# Altium schematic sheet Relay.SchDoc
size C; SheetNumber: 8; SheetTotal: 15
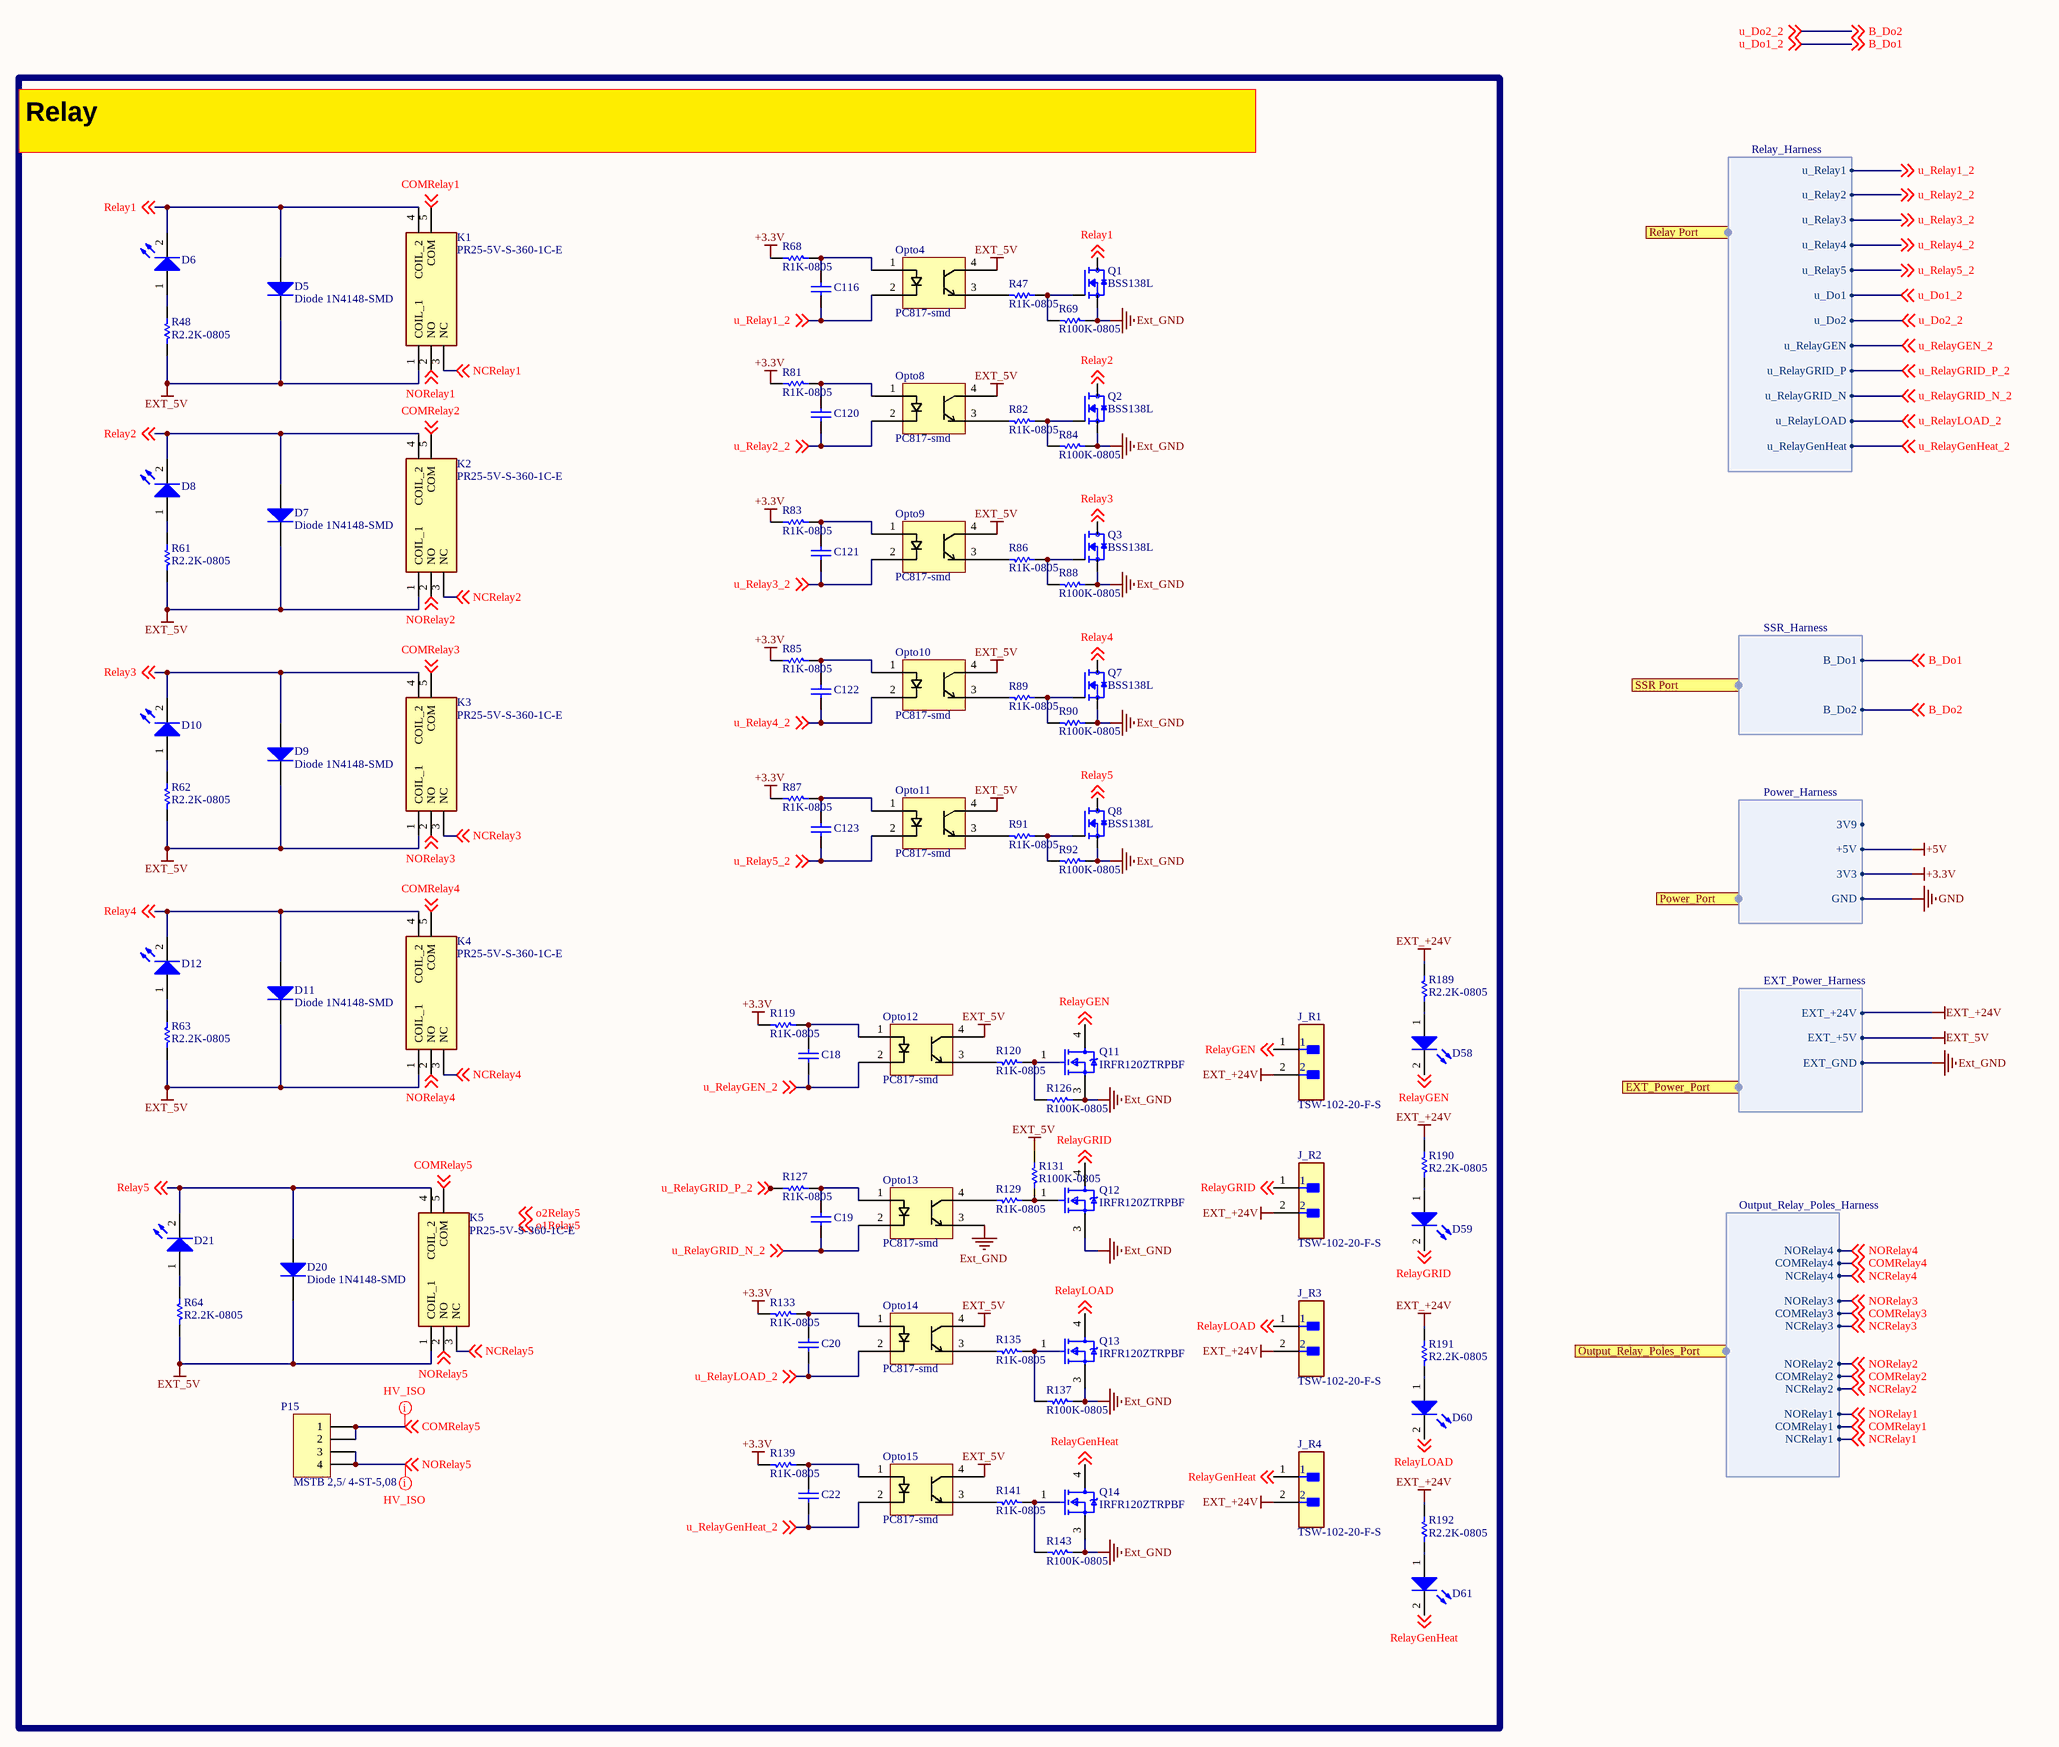
[diagram p0: Relay.SchDoc]

## Parts
C18  (no value)  [CRF06031]
C19  (no value)  [CRF06031]
C20  (no value)  [CRF06031]
C22  (no value)  [CRF06031]
C116  (no value)  [CRF06031]
C120  (no value)  [CRF06031]
C121  (no value)  [CRF06031]
C122  (no value)  [CRF06031]
C123  (no value)  [CRF06031]
D5  Diode 1N4148-SMD  [d1206]
D6  LED_0805_green  [0805-LED]  (value not drawn)
D7  Diode 1N4148-SMD  [d1206]
D8  LED_0805_green  [0805-LED]  (value not drawn)
D9  Diode 1N4148-SMD  [d1206]
D10  LED_0805_green  [0805-LED]  (value not drawn)
D11  Diode 1N4148-SMD  [d1206]
D12  LED_0805_green  [0805-LED]  (value not drawn)
D20  Diode 1N4148-SMD  [d1206]
D21  LED_0805_green  [0805-LED]  (value not drawn)
D58  LED_0805_green  [0805-LED]  (value not drawn)
D59  LED_0805_green  [0805-LED]  (value not drawn)
D60  LED_0805_green  [0805-LED]  (value not drawn)
D61  LED_0805_green  [0805-LED]  (value not drawn)
J_R1  TSW-102-20-F-S  [FP-TSW-102-12-T-S-MFG]
J_R2  TSW-102-20-F-S  [FP-TSW-102-12-T-S-MFG]
J_R3  TSW-102-20-F-S  [FP-TSW-102-12-T-S-MFG]
J_R4  TSW-102-20-F-S  [FP-TSW-102-12-T-S-MFG]
K1  PR25-5V-S-360-1C-E  [PR255VS3601CE]
K2  PR25-5V-S-360-1C-E  [PR255VS3601CE]
K3  PR25-5V-S-360-1C-E  [PR255VS3601CE]
K4  PR25-5V-S-360-1C-E  [PR255VS3601CE]
K5  PR25-5V-S-360-1C-E  [PR255VS3601CE]
Opto4  PC817-smd  [PC817_SMD1]
Opto8  PC817-smd  [PC817_SMD1]
Opto9  PC817-smd  [PC817_SMD1]
Opto10  PC817-smd  [PC817_SMD1]
Opto11  PC817-smd  [PC817_SMD1]
Opto12  PC817-smd  [PC817_SMD1]
Opto13  PC817-smd  [PC817_SMD1]
Opto14  PC817-smd  [PC817_SMD1]
Opto15  PC817-smd  [PC817_SMD1]
P15  MSTB 2,5/ 4-ST-5,08  [MSTB 2,5/4-G-5,08]
Q1  BSS138L  [BSS138L]
Q2  BSS138L  [BSS138L]
Q3  BSS138L  [BSS138L]
Q7  BSS138L  [BSS138L]
Q8  BSS138L  [BSS138L]
Q11  IRFR120ZTRPBF  [FP-PG-TO252-3-MFG]
Q12  IRFR120ZTRPBF  [FP-PG-TO252-3-MFG]
Q13  IRFR120ZTRPBF  [FP-PG-TO252-3-MFG]
Q14  IRFR120ZTRPBF  [FP-PG-TO252-3-MFG]
R47  R1K-0805  [CRF06031]
R48  R2.2K-0805  [CRF06031]
R61  R2.2K-0805  [CRF06031]
R62  R2.2K-0805  [CRF06031]
R63  R2.2K-0805  [CRF06031]
R64  R2.2K-0805  [CRF06031]
R68  R1K-0805  [CRF06031]
R69  R100K-0805  [CRF06031]
R81  R1K-0805  [CRF06031]
R82  R1K-0805  [CRF06031]
R83  R1K-0805  [CRF06031]
R84  R100K-0805  [CRF06031]
R85  R1K-0805  [CRF06031]
R86  R1K-0805  [CRF06031]
R87  R1K-0805  [CRF06031]
R88  R100K-0805  [CRF06031]
R89  R1K-0805  [CRF06031]
R90  R100K-0805  [CRF06031]
R91  R1K-0805  [CRF06031]
R92  R100K-0805  [CRF06031]
R119  R1K-0805  [CRF06031]
R120  R1K-0805  [CRF06031]
R126  R100K-0805  [CRF06031]
R127  R1K-0805  [CRF06031]
R129  R1K-0805  [CRF06031]
R131  R100K-0805  [CRF06031]
R133  R1K-0805  [CRF06031]
R135  R1K-0805  [CRF06031]
R137  R100K-0805  [CRF06031]
R139  R1K-0805  [CRF06031]
R141  R1K-0805  [CRF06031]
R143  R100K-0805  [CRF06031]
R189  R2.2K-0805  [CRF06031]
R190  R2.2K-0805  [CRF06031]
R191  R2.2K-0805  [CRF06031]
R192  R2.2K-0805  [CRF06031]

## Ports
EXT_Power_Port (harness EXT_Power_Harness), Output_Relay_Poles_Port (harness Output_Relay_Poles_Harness), Power_Port (harness Power_Harness), Relay Port (harness Relay_Harness), SSR Port (harness SSR_Harness)

## Harnesses
Relay_Harness: u_Relay1, u_Relay2, u_Relay3, u_Relay4, u_Relay5, u_Do1, u_Do2, u_RelayGEN, u_RelayGRID_P, u_RelayGRID_N, u_RelayLOAD, u_RelayGenHeat
SSR_Harness: B_Do1, B_Do2
Power_Harness: 3V9, +5V, 3V3, GND
EXT_Power_Harness: EXT_+24V, EXT_+5V, EXT_GND
Output_Relay_Poles_Harness: NCRelay1, NCRelay2, NCRelay3, NCRelay4, COMRelay1, COMRelay2, COMRelay3, COMRelay4, NORelay1, NORelay2, NORelay3, NORelay4

## Nets
+3.3V: R68.2 R81.2 R83.2 R85.2 R87.2 R119.2 R133.2 R139.2 ; port Power_Port.3V3
+5V: port Power_Port.+5V
EXT_5V: D5.2(K) D7.2(K) D9.2(K) D11.2(K) D20.2(K) K1.1(COIL_1) K2.1(COIL_1) K3.1(COIL_1) K4.1(COIL_1) K5.1(COIL_1) Opto4.4 Opto8.4 Opto9.4 Opto10.4 Opto11.4 Opto12.4 Opto14.4 Opto15.4 R48.2 R61.2 R62.2 R63.2 R64.2 R131.2 ; port EXT_Power_Port.EXT_+5V
EXT_+24V: J_R1.2 J_R2.2 J_R3.2 J_R4.2 R189.2 R190.2 R191.2 R192.2 ; port EXT_Power_Port.EXT_+24V
Ext_GND: Opto13.3 Q1.S Q2.S Q3.S Q7.S Q8.S Q11.3(SOURCE) Q12.3(SOURCE) Q13.3(SOURCE) Q14.3(SOURCE) R69.2 R84.2 R88.2 R90.2 R92.2 R126.2 R137.2 R143.2 ; port EXT_Power_Port.EXT_GND
GND: port Power_Port.GND
B_Do1: off-sheet B_Do1, off-sheet u_Do1_2, port Relay Port.u_Do1, port SSR Port.B_Do1  [also labelled u_Do1_2]
B_Do2: off-sheet B_Do2, off-sheet u_Do2_2, port Relay Port.u_Do2, port SSR Port.B_Do2  [also labelled u_Do2_2]
COMRelay1: K1.5(COM) ; off-sheet COMRelay1, port Output_Relay_Poles_Port.COMRelay1
COMRelay2: K2.5(COM) ; off-sheet COMRelay2, port Output_Relay_Poles_Port.COMRelay2
COMRelay3: K3.5(COM) ; off-sheet COMRelay3, port Output_Relay_Poles_Port.COMRelay3
COMRelay4: K4.5(COM) ; off-sheet COMRelay4, port Output_Relay_Poles_Port.COMRelay4
COMRelay5: K5.5(COM) P15.1 P15.2 ; off-sheet COMRelay5
NCRelay1: K1.3(NC) ; off-sheet NCRelay1, port Output_Relay_Poles_Port.NCRelay1
NCRelay2: K2.3(NC) ; off-sheet NCRelay2, port Output_Relay_Poles_Port.NCRelay2
NCRelay3: K3.3(NC) ; off-sheet NCRelay3, port Output_Relay_Poles_Port.NCRelay3
NCRelay4: K4.3(NC) ; off-sheet NCRelay4, port Output_Relay_Poles_Port.NCRelay4
NCRelay5: K5.3(NC) ; off-sheet NCRelay5
NORelay1: K1.2(NO) ; off-sheet NORelay1, port Output_Relay_Poles_Port.NORelay1
NORelay2: K2.2(NO) ; off-sheet NORelay2, port Output_Relay_Poles_Port.NORelay2
NORelay3: K3.2(NO) ; off-sheet NORelay3, port Output_Relay_Poles_Port.NORelay3
NORelay4: K4.2(NO) ; off-sheet NORelay4, port Output_Relay_Poles_Port.NORelay4
NORelay5: K5.2(NO) P15.3 P15.4 ; off-sheet NORelay5
Relay1: D5.1(A) D6.2(K) K1.4(COIL_2) Q1.D ; off-sheet Relay1
Relay2: D7.1(A) D8.2(K) K2.4(COIL_2) Q2.D ; off-sheet Relay2
Relay3: D9.1(A) D10.2(K) K3.4(COIL_2) Q3.D ; off-sheet Relay3
Relay4: D11.1(A) D12.2(K) K4.4(COIL_2) Q7.D ; off-sheet Relay4
Relay5: D20.1(A) D21.2(K) K5.4(COIL_2) Q8.D ; off-sheet Relay5
RelayGEN: D58.2(K) J_R1.1 Q11.4(DRAIN) ; off-sheet RelayGEN
RelayGenHeat: D61.2(K) J_R4.1 Q14.4(DRAIN) ; off-sheet RelayGenHeat
RelayGRID: D59.2(K) J_R2.1 Q12.4(DRAIN) ; off-sheet RelayGRID
RelayLOAD: D60.2(K) J_R3.1 Q13.4(DRAIN) ; off-sheet RelayLOAD
u_Relay1_2: C116.1 Opto4.2 ; off-sheet u_Relay1_2, port Relay Port.u_Relay1
u_Relay2_2: C120.1 Opto8.2 ; off-sheet u_Relay2_2, port Relay Port.u_Relay2
u_Relay3_2: C121.1 Opto9.2 ; off-sheet u_Relay3_2, port Relay Port.u_Relay3
u_Relay4_2: C122.1 Opto10.2 ; off-sheet u_Relay4_2, port Relay Port.u_Relay4
u_Relay5_2: C123.1 Opto11.2 ; off-sheet u_Relay5_2, port Relay Port.u_Relay5
u_RelayGEN_2: C18.1 Opto12.2 ; off-sheet u_RelayGEN_2, port Relay Port.u_RelayGEN
u_RelayGenHeat_2: C22.1 Opto15.2 ; off-sheet u_RelayGenHeat_2, port Relay Port.u_RelayGenHeat
u_RelayGRID_N_2: C19.1 Opto13.2 ; off-sheet u_RelayGRID_N_2, port Relay Port.u_RelayGRID_N
u_RelayGRID_P_2: R127.2 ; off-sheet u_RelayGRID_P_2, port Relay Port.u_RelayGRID_P
u_RelayLOAD_2: C20.1 Opto14.2 ; off-sheet u_RelayLOAD_2, port Relay Port.u_RelayLOAD
NetC18_2: C18.2 Opto12.1 R119.1
NetC19_2: C19.2 Opto13.1 R127.1
NetC20_2: C20.2 Opto14.1 R133.1
NetC22_2: C22.2 Opto15.1 R139.1
NetC116_2: C116.2 Opto4.1 R68.1
NetC120_2: C120.2 Opto8.1 R81.1
NetC121_2: C121.2 Opto9.1 R83.1
NetC122_2: C122.2 Opto10.1 R85.1
NetC123_2: C123.2 Opto11.1 R87.1
NetD6_1: D6.1(A) R48.1
NetD8_1: D8.1(A) R61.1
NetD10_1: D10.1(A) R62.1
NetD12_1: D12.1(A) R63.1
NetD21_1: D21.1(A) R64.1
NetD58_1: D58.1(A) R189.1
NetD59_1: D59.1(A) R190.1
NetD60_1: D60.1(A) R191.1
NetD61_1: D61.1(A) R192.1
NetOpto4_3: Opto4.3 R47.2
NetOpto8_3: Opto8.3 R82.2
NetOpto9_3: Opto9.3 R86.2
NetOpto10_3: Opto10.3 R89.2
NetOpto11_3: Opto11.3 R91.2
NetOpto12_3: Opto12.3 R120.2
NetOpto13_4: Opto13.4 R129.2
NetOpto14_3: Opto14.3 R135.2
NetOpto15_3: Opto15.3 R141.2
NetQ1_G: Q1.G R47.1 R69.1
NetQ2_G: Q2.G R82.1 R84.1
NetQ3_G: Q3.G R86.1 R88.1
NetQ7_G: Q7.G R89.1 R90.1
NetQ8_G: Q8.G R91.1 R92.1
NetQ11_1: Q11.1(GATE) R120.1 R126.1
NetQ12_1: Q12.1(GATE) R129.1 R131.1
NetQ13_1: Q13.1(GATE) R135.1 R137.1
NetQ14_1: Q14.1(GATE) R141.1 R143.1

## Layout directives
net class HV_ISO: COMRelay5, NORelay5

## Notes on the sheet
- Relay
- Labels drawn without touching a wire or pin: o1Relay5, o2Relay5

## Library data of the parts
C18-C20 C22 C116 C120-C123 = Cap: Capacitor; Manufacturer_P/N: GCM21BR72A104KA37L; Digi-Key_Part_Number: 490-4789-1-ND; JLC P/N: C85866
  C116 C120-C122: ClassName: OutputRelays
  C123: ClassName: HeaterRelay
D5 D7 D9 D11 D20 = Diode 1N4934: 1 Amp Fast Recovery Rectifier; Manufacturer_P/N: 1N4148WS; Digi-Key_Part_Number: 1N4148WSFSTR-ND; JLC P/N: C2128
  D5 D7 D9 D11: ClassName: OutputRelays
  D20: ClassName: HeaterRelay
D6 D8 D10 D12 D21 D58-D61 = LED_0805: Manufacturer_P/N: NCD0805R1; JLC P/N: C84256
  D6 D8 D10 D12: ClassName: OutputRelays
  D21: ClassName: HeaterRelay
J_R1-J_R4 = CMP-02766-001444-1: CONN HEADER VERT 2POS 2.54MM; Mount: Through Hole; Digi-Key_Part_Number: TSW-102-20-F-S-ND; Manufacturer_P/N: TSW-102-20-F-S; JLC P/N: C5993367
K1-K5 = PR25-5V-S-360-1C-E: Relay or Contactor; Manufacturer_Name: Same Sky; Manufacturer_Part_Number: PR25-5V-S-360-1C-E; Mouser Part Number: 179-PR255VS3601CE; Arrow Part Number: PR25-5V-S-360-1C-E; Digi-Key_Part_Number: 2223-PR25-5V-S-360-1C-E-ND; Manufacturer_P/N: PR25-5V-S-360-1C-E; JLC P/N: C35750544
  K1-K4: ClassName: OutputRelays
  K5: ClassName: HeaterRelay
Opto4 Opto8-Opto15 = PC817: Manufacturer_P/N: APC-817D1-SL; Digi-Key_Part_Number: 2007-APC-817D1-SLTR-ND; JLC P/N: C17448553
  Opto4 Opto8-Opto10: ClassName: OutputRelays
  Opto11: ClassName: HeaterRelay
P15 = Header 4: Conn Phonix,4 Pitch: 5.08 mm; Manufacturer_P/N: 1757268; Digi-Key_Part_Number: 277-1108-ND; JLC P/N: C90076
Q1-Q3 Q7 Q8 = BSS138L: smd; MF: ON Semiconductor; MP: BSS138L; Digi-Key_Part_Number: BSS138LTR-ND; Manufacturer_P/N: BSS138L; JLC P/N: C890265
  Q1-Q3 Q7: ClassName: OutputRelays
  Q8: ClassName: HeaterRelay
Q11-Q14 = CMP-32901-000780-1: MOSFET N-CH 100V 8.7A DPAK; Min Operating Temperature: -55°C; Mount: Surface Mount; Digi-Key_Part_Number: IRFR120ZTRPBFTR-ND; Manufacturer_P/N: IRFR120ZTRPBF; JLC P/N: C537949
R47 R68 R81-R83 R85-R87 R89 R91 R119 R120 R127 R129 R133 R135 R139 R141 = Res1: Resistor; Manufacturer_P/N: RC0805FR-071KL; Digi-Key_Part_Number: 311-1.00KCRTR-ND; JLC P/N: C95781
  R47 R68 R81-R83 R85 R86 R89: ClassName: OutputRelays
  R87 R91: ClassName: HeaterRelay
R48 R61-R64 R189-R192 = Res1: Resistor; Manufacturer_P/N: RC0805FR-072K2L; Digi-Key_Part_Number: 311-2.20KCRTR-ND; JLC P/N: C114561
  R48 R61-R63: ClassName: OutputRelays
  R64: ClassName: HeaterRelay
R69 R84 R88 R90 R92 R126 R131 R137 R143 = Res1: Resistor; Manufacturer_P/N: RC0805FR-07100KL; Digi-Key_Part_Number: 311-100KCRTR-ND; JLC P/N: C96346
  R69 R84 R88 R90: ClassName: OutputRelays
  R92: ClassName: HeaterRelay